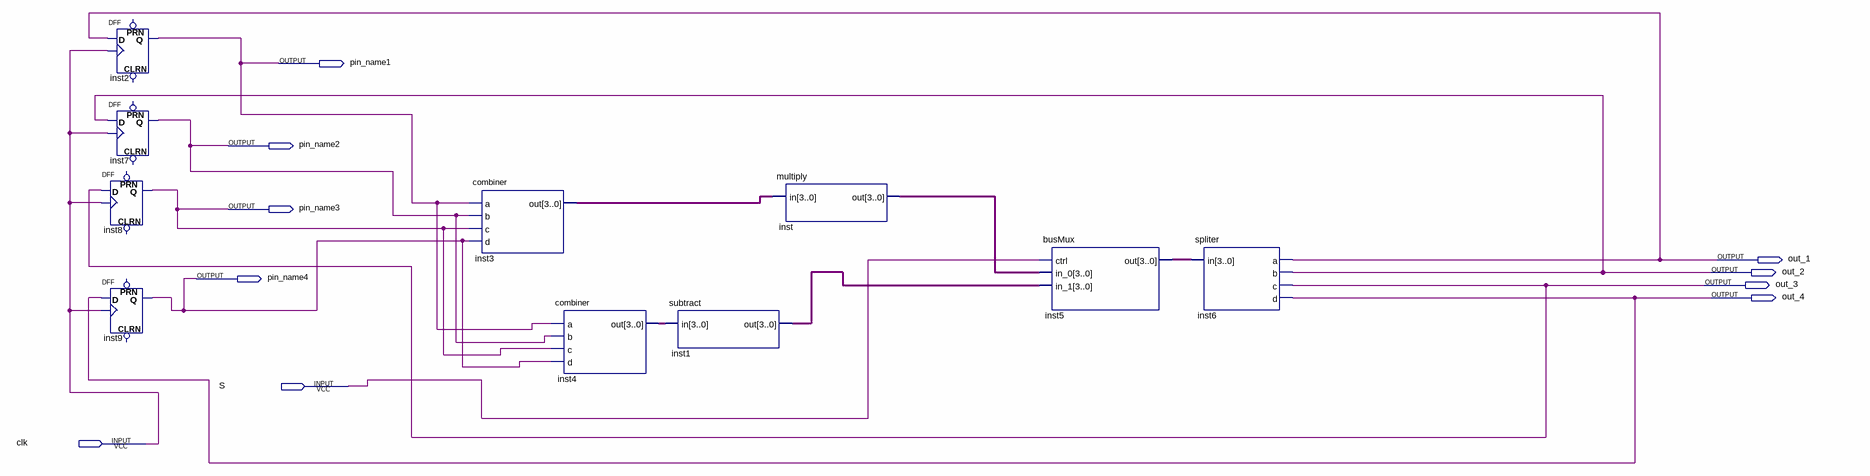
[diagram p0: schematic sheet]
// Quartus schematic state.bdf as structural Verilog: 10 symbols, 10 pins
module state (
  input  S,
  input  clk,
  output pin_name1,
  output pin_name2,
  output pin_name3,
  output out_1,
  output out_2,
  output pin_name4,
  output out_3,
  output out_4
);

  wire [3:0] inst1_out, inst3_out, inst4_out, inst5_out, inst_out;

  DFF inst2 (.CLK(clk), .D(out_1), .Q(pin_name1));  // open: CLRN, PRN
  DFF inst7 (.CLK(clk), .D(out_2), .Q(pin_name2));  // open: CLRN, PRN
  DFF inst8 (.CLK(clk), .D(out_3), .Q(pin_name3));  // open: CLRN, PRN
  DFF inst9 (.CLK(clk), .D(out_4), .Q(pin_name4));  // open: CLRN, PRN
  combiner inst3 (.a(pin_name1), .b(pin_name2), .c(pin_name3), .d(pin_name4), .out(inst3_out));
  combiner inst4 (.a(pin_name1), .b(pin_name2), .c(pin_name3), .d(pin_name4), .out(inst4_out));
  subtract inst1 (.in(inst4_out), .out(inst1_out));
  multiply inst (.in(inst3_out), .out(inst_out));
  busMux inst5 (.ctrl(S), .in_0(inst_out), .in_1(inst1_out), .out(inst5_out));
  spliter inst6 (.in(inst5_out), .a(out_1), .b(out_2), .c(out_3), .d(out_4));
endmodule
